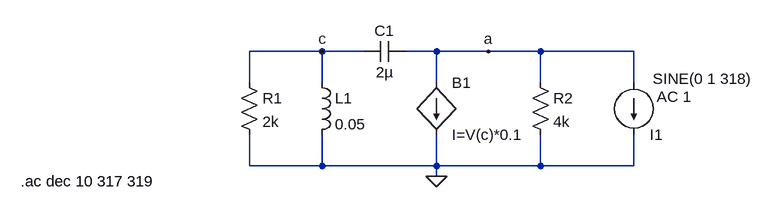
[diagram p0: schematic Task3-thevinin.asc]
Task3-thevinin.asc, the LTspice schematic file:
Version 4
SHEET 1 1048 680
WIRE 368 64 256 64
WIRE 432 64 368 64
WIRE 544 64 496 64
WIRE 624 64 544 64
WIRE 704 64 624 64
WIRE 848 64 704 64
WIRE 256 112 256 64
WIRE 368 112 368 64
WIRE 544 112 544 64
WIRE 704 112 704 64
WIRE 848 112 848 64
WIRE 256 240 256 192
WIRE 368 240 368 192
WIRE 368 240 256 240
WIRE 544 240 544 192
WIRE 544 240 368 240
WIRE 704 240 704 192
WIRE 704 240 544 240
WIRE 848 240 848 192
WIRE 848 240 704 240
WIRE 544 256 544 240
FLAG 624 64 a
FLAG 368 64 c
FLAG 544 256 0
SYMBOL res 240 96 R0
SYMATTR InstName R1
SYMATTR Value 2k
SYMBOL ind 352 96 R0
SYMATTR InstName L1
SYMATTR Value 0.05
SYMBOL cap 496 48 R90
WINDOW 0 0 32 VBottom 2
WINDOW 3 32 32 VTop 2
SYMATTR InstName C1
SYMATTR Value 2µ
SYMBOL res 688 96 R0
SYMATTR InstName R2
SYMATTR Value 4k
SYMBOL bi 544 112 R0
SYMATTR InstName B1
SYMATTR Value I=V(c)*0.1
SYMBOL current 848 112 R0
WINDOW 0 24 80 Left 2
WINDOW 3 29 -6 Left 2
WINDOW 123 35 22 Left 2
WINDOW 39 0 0 Left 0
SYMATTR InstName I1
SYMATTR Value SINE(0 1 318)
SYMATTR Value2 AC 1
TEXT -96 264 Left 2 !.ac dec 10 317 319

The netlist it stands for:
* Task3-thevinin.asc
R1 c 0 2k
L1 c 0 0.05
C1 a c 2µ
R2 a 0 4k
B1 a 0 I=V(c)*0.1
I1 a 0 SINE(0 1 318) AC 1
.ac dec 10 317 319
.backanno
.end

* Results of the author's LTspice run, read from the files saved beside the schematic
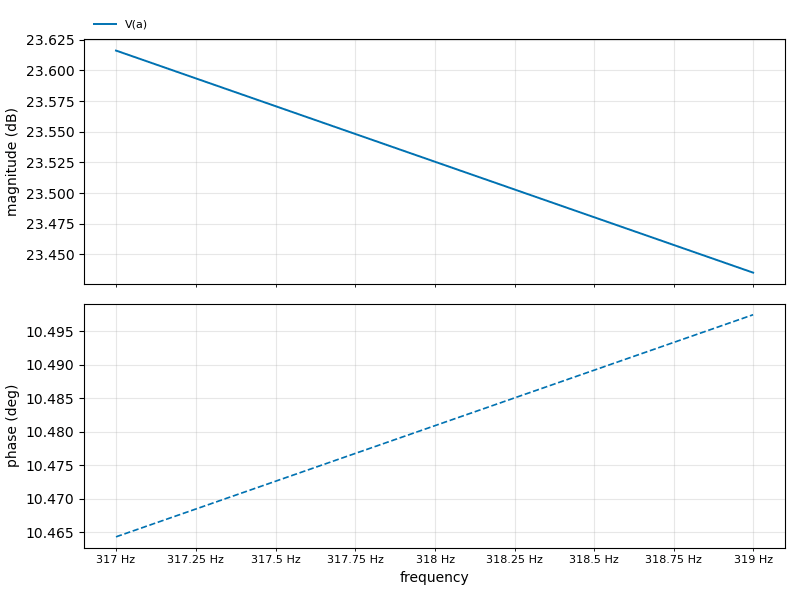
[diagram p1: AC Analysis of Task3-thevinin.asc, plotted from the saved traces]
* AC Analysis, 1 run:
*   V(a): 23.62 dB at 317 Hz, 23.44 dB at 319 Hz, peak 23.62 dB at 317 Hz